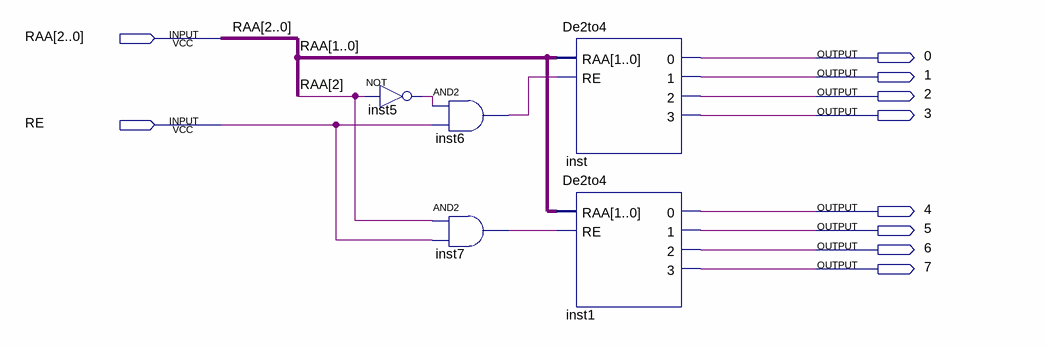
[diagram p0: schematic sheet]
// Quartus schematic De3to8.bdf as structural Verilog: 5 symbols, 10 pins
module De3to8 (
  input  [2:0] RAA,
  input  RE,
  output \0 ,
  output \1 ,
  output \2 ,
  output \3 ,
  output \4 ,
  output \5 ,
  output \6 ,
  output \7 
);

  wire inst5_out, inst6_out, inst7_out;

  not inst5 (inst5_out, RAA[2]);
  and inst6 (inst6_out, inst5_out, RE);
  and inst7 (inst7_out, RAA[2], RE);
  De2to4 inst (.RAA(RAA[1:0]), .RE(inst6_out), .\0 (\0 ), .\1 (\1 ), .\2 (\2 ), .\3 (\3 ));
  De2to4 inst1 (.RAA(RAA[1:0]), .RE(inst7_out), .\0 (\4 ), .\1 (\5 ), .\2 (\6 ), .\3 (\7 ));
endmodule
